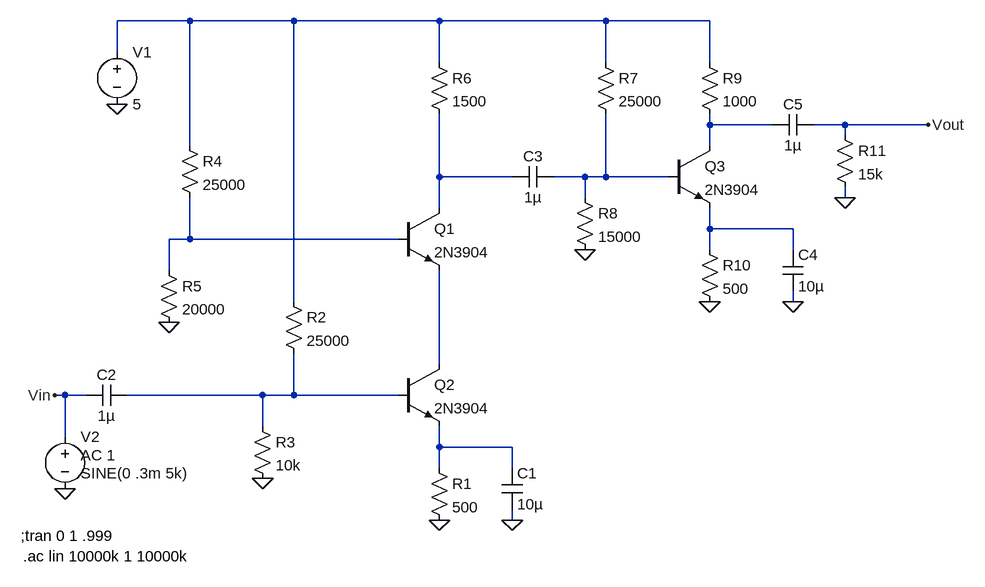
[diagram p0: schematic 04B-350.asc]
04B-350.asc, the LTspice schematic file:
Version 4
SHEET 1 1048 696
WIRE -160 -144 -272 -144
WIRE 0 -144 -160 -144
WIRE 224 -144 0 -144
WIRE 480 -144 224 -144
WIRE 640 -144 480 -144
WIRE -272 -96 -272 -144
WIRE 224 -80 224 -144
WIRE 480 -80 480 -144
WIRE 640 -80 640 -144
WIRE 640 16 640 0
WIRE 736 16 640 16
WIRE 848 16 800 16
WIRE 976 16 848 16
WIRE 848 32 848 16
WIRE -160 48 -160 -144
WIRE 640 48 640 16
WIRE 224 96 224 0
WIRE 336 96 224 96
WIRE 448 96 400 96
WIRE 480 96 480 0
WIRE 480 96 448 96
WIRE 576 96 480 96
WIRE 448 128 448 96
WIRE 848 128 848 112
WIRE 224 144 224 96
WIRE 640 176 640 144
WIRE 768 176 640 176
WIRE -160 192 -160 128
WIRE -160 192 -192 192
WIRE 160 192 -160 192
WIRE 640 208 640 176
WIRE 768 208 768 176
WIRE -192 240 -192 192
WIRE 0 288 0 -144
WIRE 768 288 768 272
WIRE 224 384 224 240
WIRE -352 432 -368 432
WIRE -320 432 -352 432
WIRE -48 432 -256 432
WIRE 0 432 0 368
WIRE 0 432 -48 432
WIRE 160 432 0 432
WIRE -48 480 -48 432
WIRE -352 496 -352 432
WIRE 224 512 224 480
WIRE 336 512 224 512
WIRE 224 544 224 512
WIRE 336 544 336 512
WIRE 336 624 336 608
FLAG -192 320 0
FLAG -272 -16 0
FLAG 224 624 0
FLAG 336 624 0
FLAG -48 560 0
FLAG -368 432 Vin
FLAG -352 576 0
FLAG 640 288 0
FLAG 768 288 0
FLAG 448 208 0
FLAG 976 16 Vout
FLAG 848 128 0
SYMBOL npn 160 144 R0
SYMATTR InstName Q1
SYMATTR Value 2N3904
SYMBOL res -176 32 R0
SYMATTR InstName R4
SYMATTR Value 25000
SYMBOL res -208 224 R0
SYMATTR InstName R5
SYMATTR Value 20000
SYMBOL res 208 -96 R0
SYMATTR InstName R6
SYMATTR Value 1500
SYMBOL voltage -272 -112 R0
WINDOW 123 0 0 Left 0
WINDOW 39 0 0 Left 0
SYMATTR InstName V1
SYMATTR Value 5
SYMBOL npn 160 384 R0
SYMATTR InstName Q2
SYMATTR Value 2N3904
SYMBOL res 208 528 R0
SYMATTR InstName R1
SYMATTR Value 500
SYMBOL cap 320 544 R0
SYMATTR InstName C1
SYMATTR Value 10µ
SYMBOL cap -256 416 R90
WINDOW 0 0 32 VBottom 2
WINDOW 3 32 32 VTop 2
SYMATTR InstName C2
SYMATTR Value 1µ
SYMBOL res -16 272 R0
SYMATTR InstName R2
SYMATTR Value 25000
SYMBOL res -64 464 R0
SYMATTR InstName R3
SYMATTR Value 10k
SYMBOL voltage -352 480 R0
WINDOW 123 24 44 Left 2
WINDOW 39 0 0 Left 0
WINDOW 3 24 72 Left 2
SYMATTR Value2 AC 1
SYMATTR Value SINE(0 .3m 5k)
SYMATTR InstName V2
SYMBOL cap 400 80 R90
WINDOW 0 0 32 VBottom 2
WINDOW 3 32 32 VTop 2
SYMATTR InstName C3
SYMATTR Value 1µ
SYMBOL res 464 -96 R0
SYMATTR InstName R7
SYMATTR Value 25000
SYMBOL res 432 112 R0
SYMATTR InstName R8
SYMATTR Value 15000
SYMBOL npn 576 48 R0
SYMATTR InstName Q3
SYMATTR Value 2N3904
SYMBOL res 624 -96 R0
SYMATTR InstName R9
SYMATTR Value 1000
SYMBOL res 624 192 R0
SYMATTR InstName R10
SYMATTR Value 500
SYMBOL cap 752 208 R0
SYMATTR InstName C4
SYMATTR Value 10µ
SYMBOL cap 800 0 R90
WINDOW 0 0 32 VBottom 2
WINDOW 3 32 32 VTop 2
SYMATTR InstName C5
SYMATTR Value 1µ
SYMBOL res 832 16 R0
SYMATTR InstName R11
SYMATTR Value 15k
TEXT -420 648 Left 2 !;tran 0 1 .999
TEXT -416 680 Left 2 !.ac lin 10000k 1 10000k

The netlist it stands for:
* 04B-350.asc
Q1 N003 N006 N007 0 2N3904
R4 N001 N006 25000
R5 N006 0 20000
R6 N001 N003 1500
V1 N001 0 5
Q2 N007 N008 N009 0 2N3904
R1 N009 0 500
C1 N009 0 10µ
C2 N008 Vin 1µ
R2 N001 N008 25000
R3 N008 0 10k
V2 Vin 0 SINE(0 .3m 5k) AC 1
C3 N004 N003 1µ
R7 N001 N004 25000
R8 N004 0 15000
Q3 N002 N004 N005 0 2N3904
R9 N001 N002 1000
R10 N005 0 500
C4 N005 0 10µ
C5 Vout N002 1µ
R11 Vout 0 15k
.model NPN NPN
.model PNP PNP
.lib standard.bjt
;tran 0 1 .999
.ac lin 10000k 1 10000k
.backanno
.end